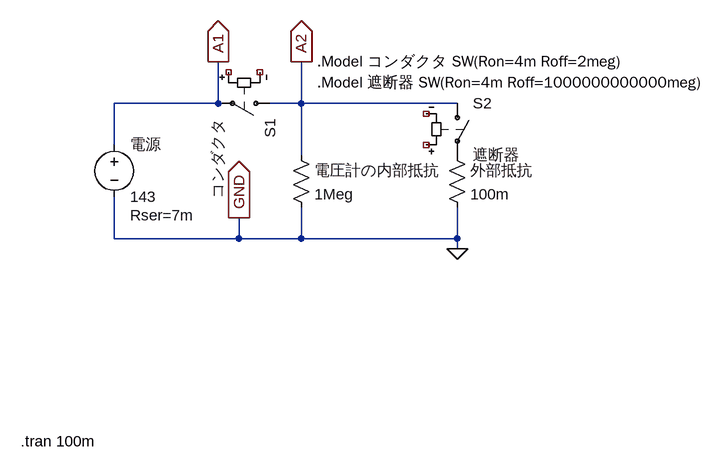
[diagram p0: schematic external-short-circuit-test_trauble.asc]
external-short-circuit-test_trauble.asc, the LTspice schematic file:
Version 4
SHEET 1 1392 680
WIRE 352 -112 352 -176
WIRE 352 -112 192 -112
WIRE 368 -112 352 -112
WIRE 480 -112 480 -176
WIRE 480 -112 432 -112
WIRE 720 -112 480 -112
WIRE 192 -48 192 -112
WIRE 480 -32 480 -112
WIRE 192 96 192 32
WIRE 384 96 384 64
WIRE 384 96 192 96
WIRE 480 96 480 48
WIRE 480 96 384 96
WIRE 720 96 720 48
WIRE 720 96 480 96
WIRE 720 112 720 96
FLAG 720 112 0
FLAG 352 -176 A1
IOPIN 352 -176 Out
FLAG 480 -176 A2
IOPIN 480 -176 Out
FLAG 384 64 GND
IOPIN 384 64 Out
SYMBOL voltage 192 -64 R0
WINDOW 123 0 0 Left 0
WINDOW 39 24 124 Left 2
SYMATTR SpiceLine Rser=7m
SYMATTR InstName 電源
SYMATTR Value 143
SYMBOL sw 448 -112 R90
SYMATTR InstName S1
SYMATTR Value コンダクタ
SYMBOL sw 720 -128 R0
SYMATTR InstName S2
SYMATTR Value 遮断器
SYMBOL res 704 -48 R0
SYMATTR InstName 外部抵抗
SYMATTR Value 100m
SYMBOL res 464 -48 R0
SYMATTR InstName 電圧計の内部抵抗
SYMATTR Value 1Meg
TEXT 48 408 Left 2 !.tran 100m
TEXT 504 -176 Left 2 !.Model コンダクタ SW(Ron=4m Roff=2meg)
TEXT 504 -144 Left 2 !.Model 遮断器 SW(Ron=4m Roff=1000000000000meg)

The netlist it stands for:
* external-short-circuit-test_trauble.asc
V§電源 A1 0 143 Rser=7m
* S1: コンダクタ (symbol sw not certain, pin order unknown); nets seen at it: A1, A2
S2 A2 P001 NC_03 NC_04 遮断器
R§外部抵抗 P001 0 100m
R§電圧計の内部抵抗 A2 0 1Meg
.tran 100m
.Model コンダクタ SW(Ron=4m Roff=2meg)
.Model 遮断器 SW(Ron=4m Roff=1000000000000meg)
.backanno
.end